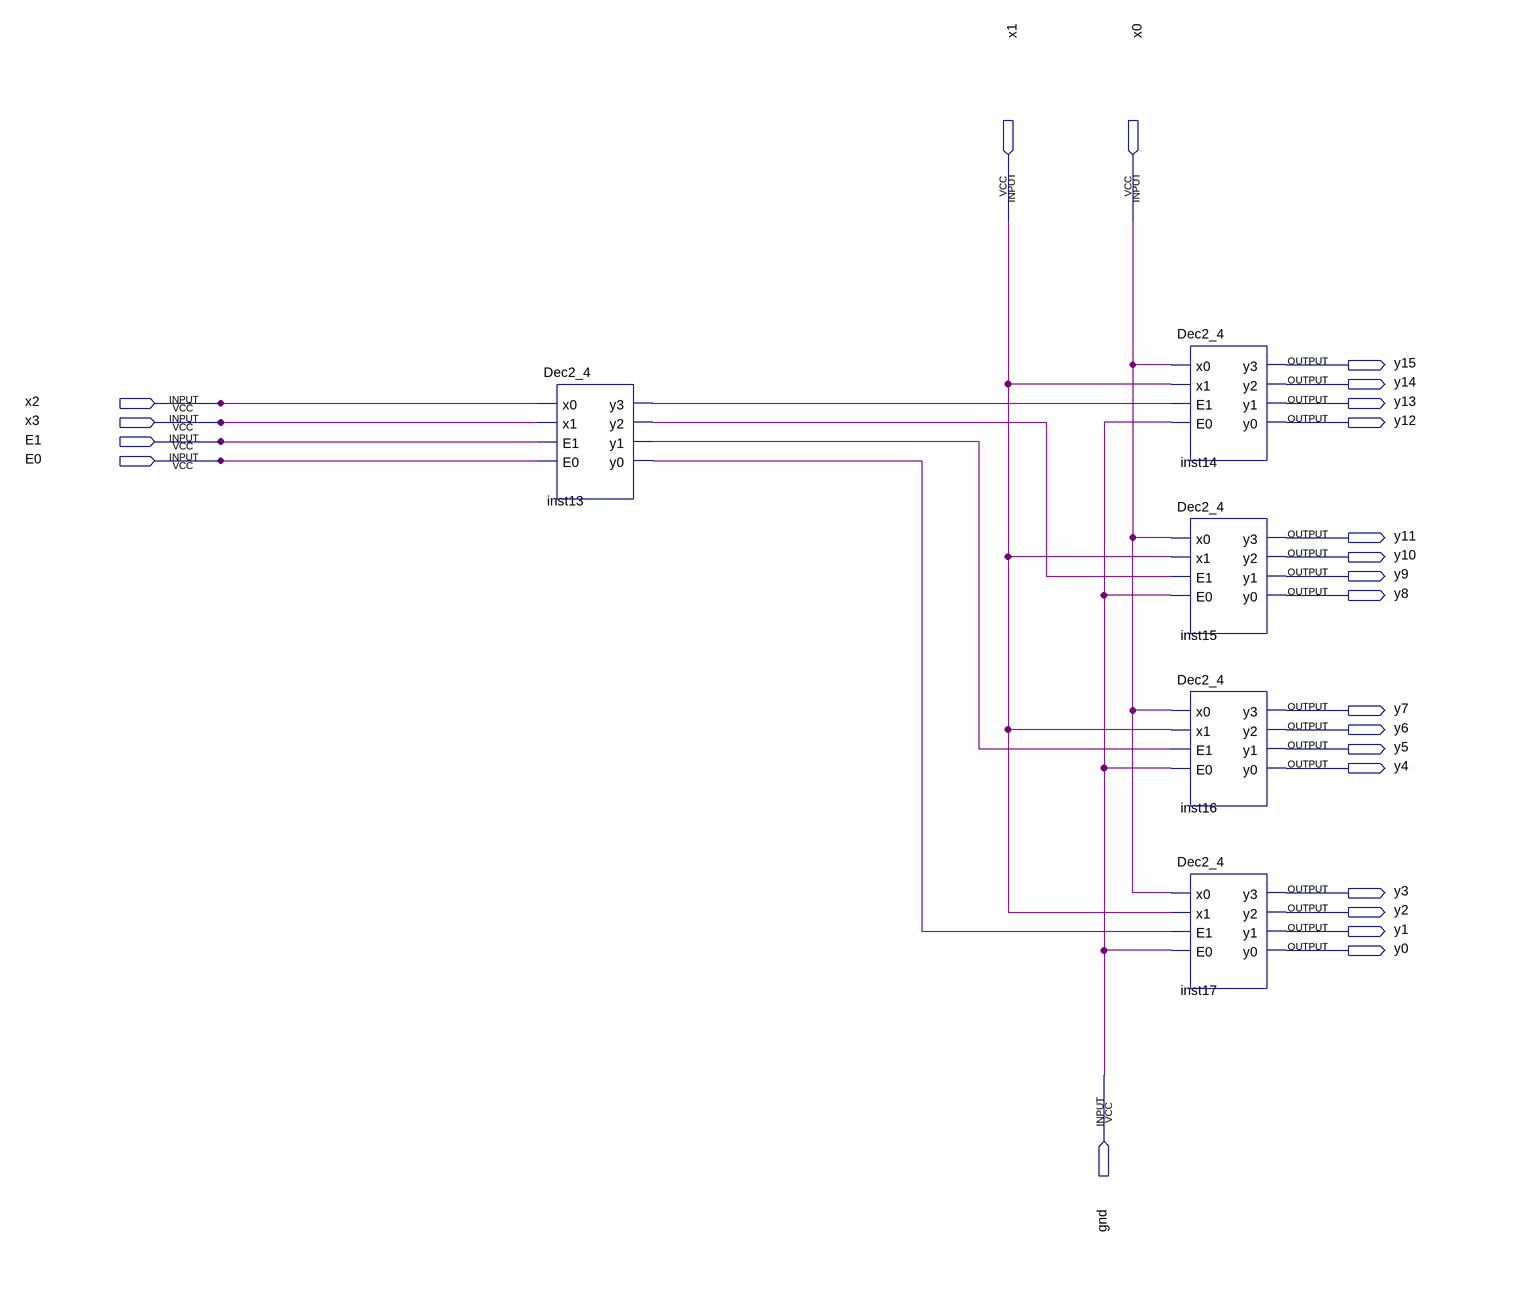
[diagram p0: schematic sheet]
// Quartus schematic Dec4_16.bdf as structural Verilog: 5 symbols, 23 pins
module Dec4_16 (
  input  x1,
  input  x0,
  input  x2,
  input  x3,
  input  E1,
  input  E0,
  input  gnd,
  output y15,
  output y14,
  output y13,
  output y12,
  output y11,
  output y10,
  output y9,
  output y8,
  output y7,
  output y6,
  output y5,
  output y4,
  output y3,
  output y2,
  output y1,
  output y0
);

  wire inst13_y0, inst13_y1, inst13_y2, inst13_y3;

  Dec2_4 inst13 (.x0(x2), .x1(x3), .E1(E1), .E0(E0), .y3(inst13_y3), .y2(inst13_y2), .y1(inst13_y1), .y0(inst13_y0));
  Dec2_4 inst14 (.x0(x0), .x1(x1), .E1(inst13_y3), .E0(gnd), .y3(y15), .y2(y14), .y1(y13), .y0(y12));
  Dec2_4 inst15 (.x0(x0), .x1(x1), .E1(inst13_y2), .E0(gnd), .y3(y11), .y2(y10), .y1(y9), .y0(y8));
  Dec2_4 inst16 (.x0(x0), .x1(x1), .E1(inst13_y1), .E0(gnd), .y3(y7), .y2(y6), .y1(y5), .y0(y4));
  Dec2_4 inst17 (.x0(x0), .x1(x1), .E1(inst13_y0), .E0(gnd), .y3(y3), .y2(y2), .y1(y1), .y0(y0));
endmodule
